# EAGLE design ActiveHeadphoneSMT (EAGLE 6.2)
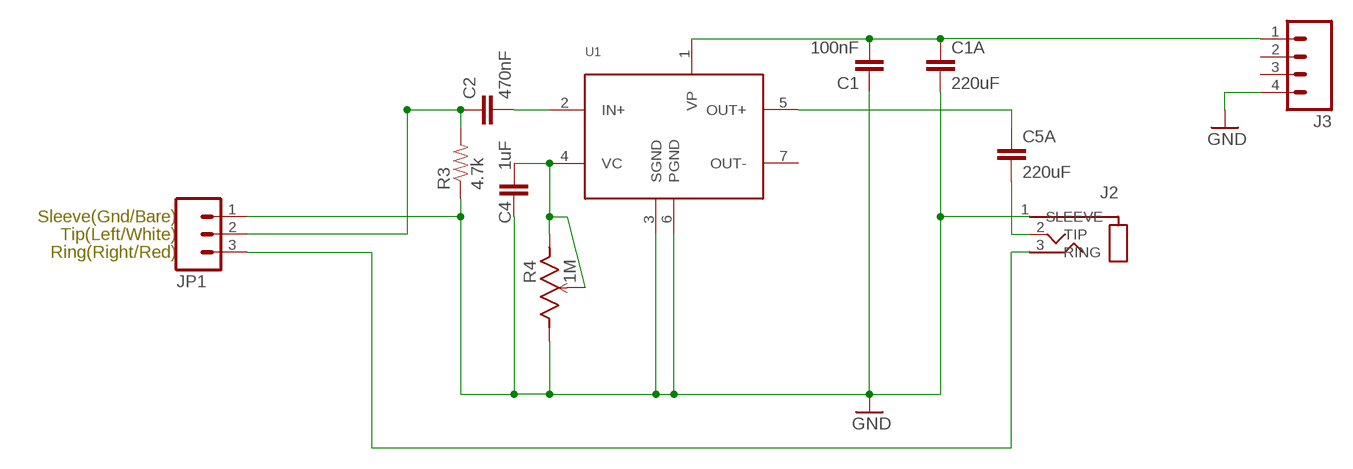
[diagram p0: schematic, sheet 1]

## Parts
C1  100nF  CAP0603-CAP  [0603-CAP]
C1A  220uF  CAPPTH1  [CAP-PTH-5MM]
C2  470nF  CAP0603-CAP  [0603-CAP]
C4  1uF  CAP0603-CAP  [0603-CAP]
C5A  220uF  CAPPTH1  [CAP-PTH-5MM]
J2  SJ1-35XXPTH  [SJ1-3523N]
J3  M04PTH  [1X04]
JP1  M03PTH  [1X03]
R3  4.7k  RESISTOR0603-RES  [0603-RES]
R4  1M  3352T  [3352T]
U1  TDA7052  [DIL-8]

## Nets
GND: C1.1 C1A.2 C4.1 J2.1(SLEEVE) J3.4 JP1.1 R3.1 R4.1(CCW) U1.3(SGND) U1.6(PGND)
N$1: C2.2 U1.2(IN+)
N$2: C2.1 JP1.2 R3.2
N$3: C5A.2 J2.2(TIP)
N$4: C4.2 R4.2(WIPER) R4.3(CW) U1.4(VC)
N$5: C1.2 C1A.1 J3.1 U1.1(VP)
N$6: C5A.1 U1.5(OUT+)
N$7: J2.3(RING) JP1.3
Unconnected: J3.2 J3.3 U1.7(OUT-)

## Notes on the sheet
- Sleeve(Gnd/Bare)
- Tip(Left/White)
- Ring(Right/Red)

## Library data of the parts
C1 C2 C4 = SparkFun-Passives:CAP: Capacitor Standard 0603 ceramic capacitor, and 0.1" leaded capacitor.
C1A C5A = SparkFun:CAP: Capacitor Standard 0603 ceramic capacitor, and 0.1" leaded capacitor.
J2 = KwanSystems:SJ1-35XX
J3 = SparkFun:M04: Header 4 Standard 4-pin 0.1" header. Use with straight break away headers (SKU : PRT-00116), right angle break away headers (PRT-00553), swiss pins (PRT-00743), machine pins (PRT-00117), and female headers (PRT-00115). Molex polarized connector foot print use with SKU : PRT-08231 with associated crimp pins and housings. 1MM SMD Version SKU: PRT-10208
JP1 = SparkFun-Connectors:M03: Header 3 Standard 3-pin 0.1" header. Use with straight break away headers (SKU : PRT-00116), right angle break away headers (PRT-00553), swiss pins (PRT-00743), machine pins (PRT-00117), and female headers (PRT-00115). Molex polarized connector foot print use with SKU : PRT-08232 with associated crimp pins and housings.
R3 = SparkFun-Passives:RESISTOR: Resistor Basic schematic elements and footprints for 0603, 1206, and PTH resistors.
R4 = KwanSystems:3352T
U1 = KwanSystems:TDA7052

## Net classes
0 default: width 0.33 mm, drill 0.33 mm, clearance 0.33 mm

## Board
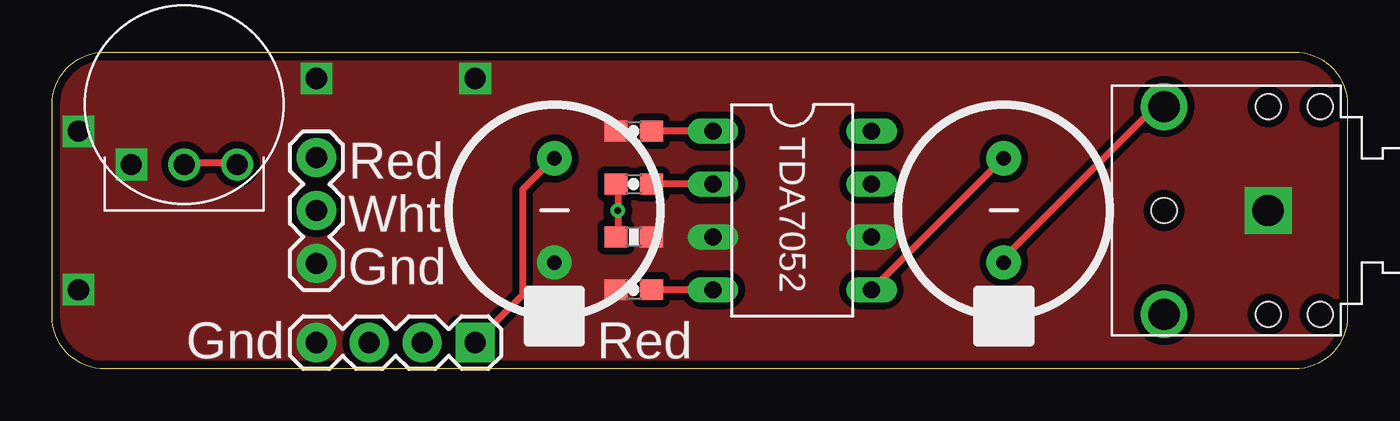
[diagram p1: board, top side]
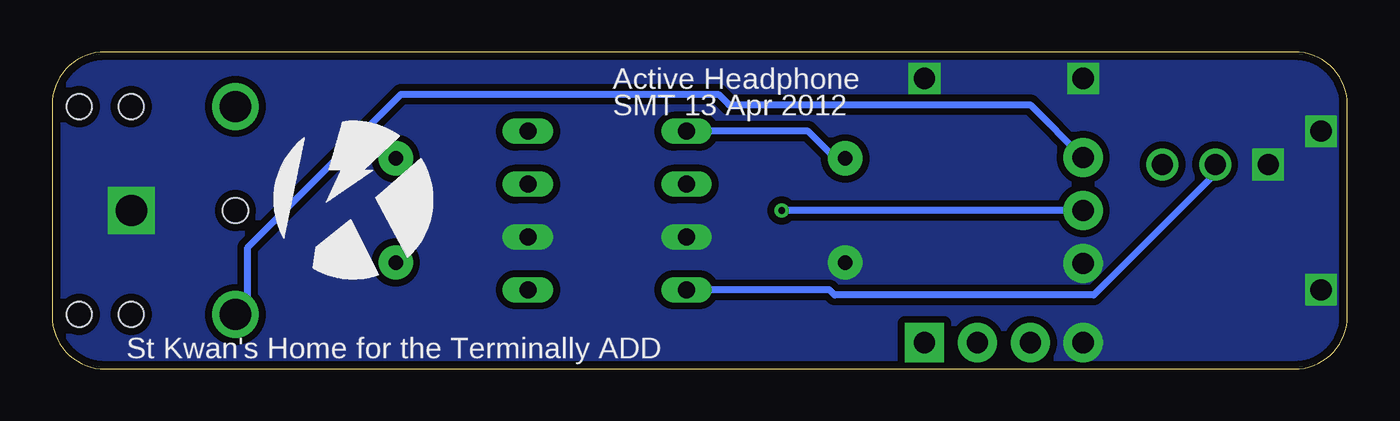
[diagram p2: board, bottom side, seen from below]

Size 62.23 x 15.24 mm. Coordinates in mm from the lower left corner, seen from the top.
Outline: 0,2.54 0,12.7 arc-90 2.54,15.24 59.69,15.24 arc-90 62.23,12.7 62.23,2.54 arc-90 59.69,0 2.54,0 arc-90 0,2.54
Copper layers (1*16): Top 0.0356mm / dielectric 1.5011mm / Bottom 0.0356mm
Design rules: minimum track width 6mil, minimum drill 13mil, track to track 6mil, track to pad 6mil, pad to pad 6mil, via to via 6mil, smd to smd 6mil, copper to edge 15mil, drill to drill 6mil, minimum pad ring 7mil, minimum via ring 7mil, stop-mask expansion 4mil, vias tented up to drill 0mil, thermal gap 10mil

### Footprints (pad centres in the part's own frame; a part is rotated, then mirrored left to right if it is on the bottom)
0603-CAP = smd 1.1 x 1: 1 -0.85,0; 2 0.85,0
CAP-PTH-5MM = drill 0.7 pad 1.651: 1 -2.5,0; 2 2.5,0
SJ1-3523N = drill 1.5 square: 1 0,0 | drill 1.5: 2 5,-5; 3 5,5 | hole 1.2: 0,-5; -2.5,-5; -2.5,5; 0,5; 5,0
1X04 = drill 1.016 pad 1.88 square: 1 0,0 | drill 1.016 pad 1.88: 2 2.54,0; 3 5.08,0; 4 7.62,0
1X03 = drill 1.016 pad 1.88: 1 0,0; 2 2.54,0; 3 5.08,0
0603-RES = smd 1.1 x 1: 1 -0.85,0; 2 0.85,0
3352T = drill 1.016 square: 1 -2.54,-2.87 | drill 1.016: 2 0,-2.87; 3 2.54,-2.87
DIL-8 = drill 0.813 long: 1 -3.81,-3.81; 2 -1.27,-3.81; 3 1.27,-3.81; 4 3.81,-3.81; 5 3.81,3.81; 6 1.27,3.81; 7 -1.27,3.81; 8 -3.81,3.81

### Placement (x,y rotation side)
C1  27.94,11.43 0 top
C1A  24.13,7.62 270 top
C2  27.94,8.89 0 top
C4  27.94,3.81 0 top
C5A  45.72,7.62 270 top
J2  58.42,7.62 180 top
J3  20.32,1.27 180 top
JP1  12.7,5.08 90 top
R3  27.94,6.35 180 top
R4  6.35,12.7 0 top
U1  35.56,7.62 270 top
U$1  [KWAN_CIRCLE]  47.75,8.13 0 bottom

### Tracks (layer width: path | path; a pad name or v marks a point on that pad's centre or on a via)
GND  (via drill 1.02)
  other vias: 20.32,13.97 1.27,3.81 12.7,13.97 1.27,11.43
  pour Bottom (no thermals): 2.54,15.24 59.69,15.24 arc-90 62.23,12.7 62.23,2.54 arc-90 59.69,0 2.54,0 arc-90 0,2.54 0,12.7 arc-90
  pour Top (no thermals): 2.54,15.24 59.69,15.24 arc-90 62.23,12.7 62.23,2.54 arc-90 59.69,0 2.54,0 arc-90 0,2.54 0,12.7 arc-90
N$1
  Top 0.33: U1.2 C2.2
N$2  (via drill 0.33)
  Top 0.33: R3.2 27.18,6.35 v27.18,7.62 27.18,8.89 C2.1
  Bottom 0.33: JP1.2 v27.18,7.62
N$3
  Top 0.33: C5A.2 45.72,5.33 52.83,12.45 53.34,12.45 J2.2
N$4
  Top 0.33: U1.4 C4.2 | R4.2 6.35,9.91 8.89,9.91 R4.3
  Bottom 0.33: U1.4 24.89,3.81 24.64,3.56 12.19,3.56 6.35,9.4 R4.2
N$5
  Top 0.33: U1.1 C1.2 | J3.1 22.61,3.56 22.61,8.64 24.13,10.16 C1A.1
  Bottom 0.33: U1.1 25.91,11.43 24.64,10.16 24.13,10.16 C1A.1
N$6
  Top 0.33: U1.5 45.72,10.16 C5A.1
N$7
  Bottom 0.33: JP1.3 15.24,12.7 29.72,12.7 30.23,13.21 45.47,13.21 52.83,5.84 52.83,2.79 53.34,2.79 J2.3

### Text on the board
tPlace: Red | Wht | Gnd | Gnd | Red
bPlace: Active Headphone | SMT 13 Apr 2012 | St Kwan's Home for the Terminally ADD